# EAGLE design A_W_Sensor (EAGLE 6.4)
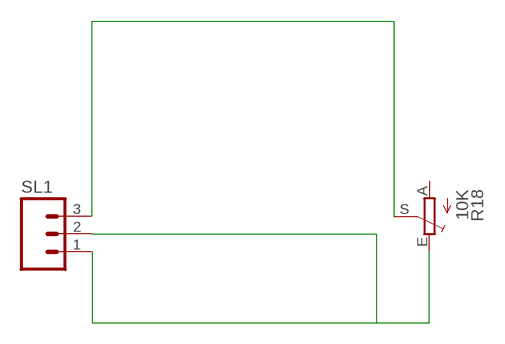
[diagram p0: schematic, sheet 1]

## Parts
R18  10K  TRIM_EU-CA6V  [CA6V]
SL1  M03  [03P]

## Nets
N$1: R18.S SL1.3
N$2: R18.E SL1.1 SL1.2
Unconnected: R18.A

## Library data of the parts
R18 = pot:TRIM_EU-: POTENTIOMETER
SL1 = con-amp-quick:M03: AMP QUICK CONNECTOR; OC_FARNELL: unknown; OC_NEWARK: unknown

## Net classes
0 default: width 0.254 mm, drill 0.305 mm, clearance 0.152 mm

## Board
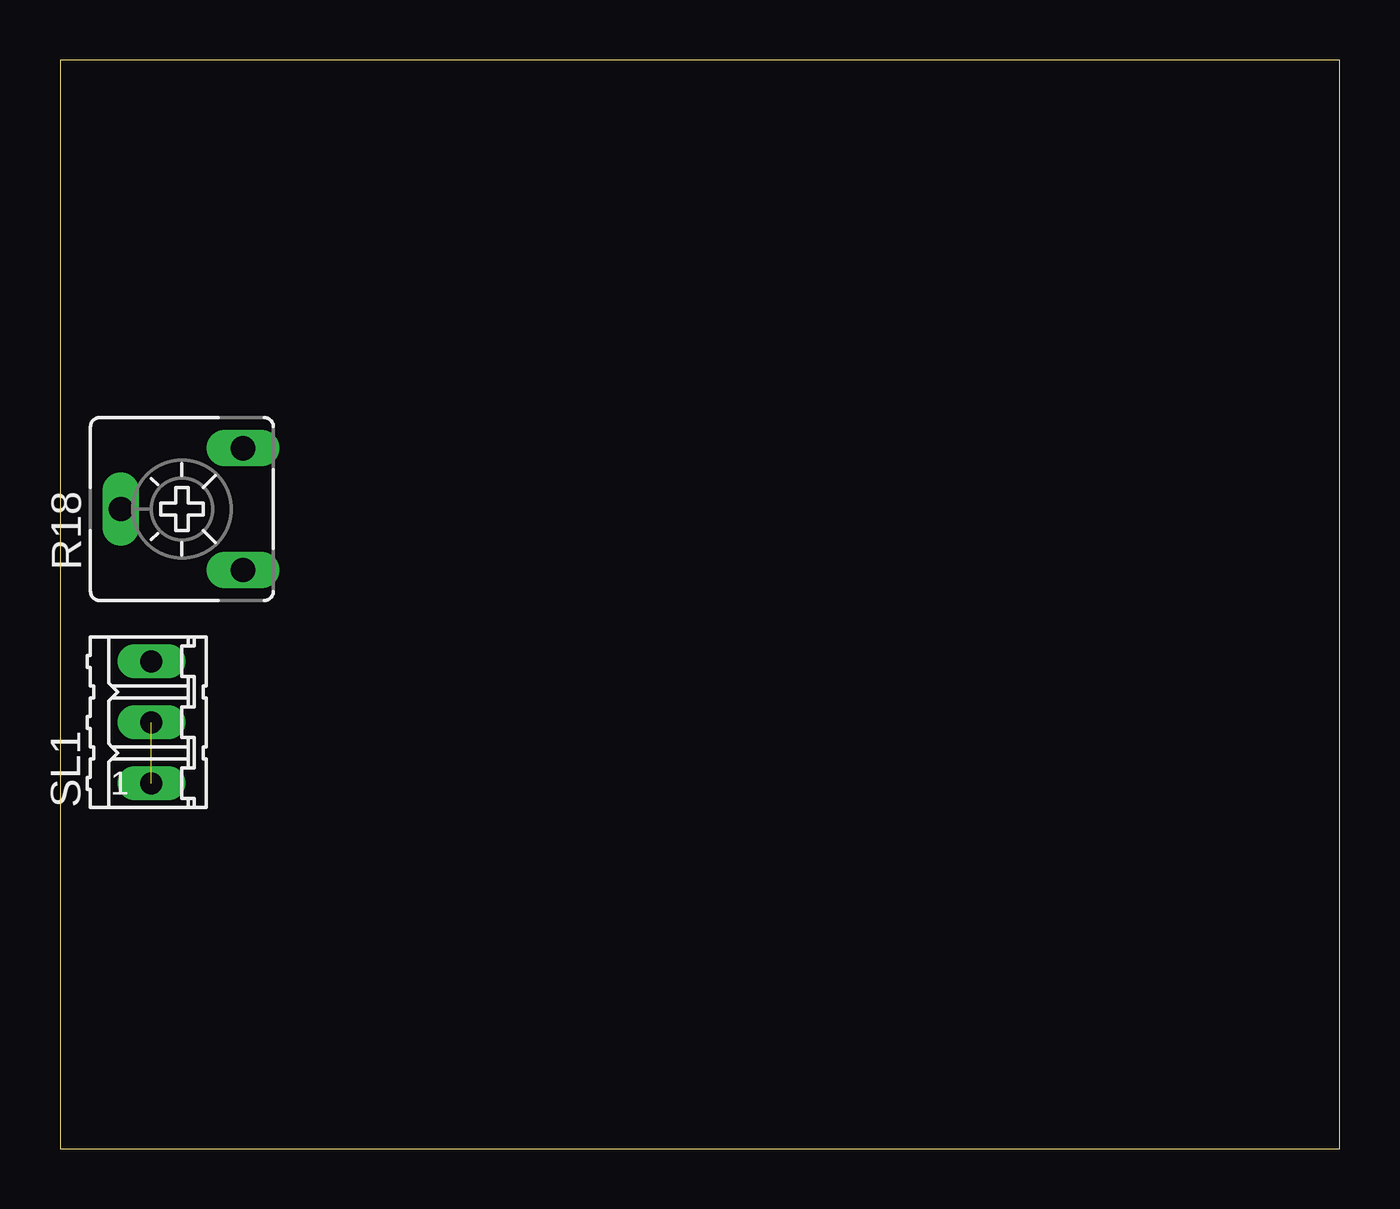
[diagram p1: board, top side]
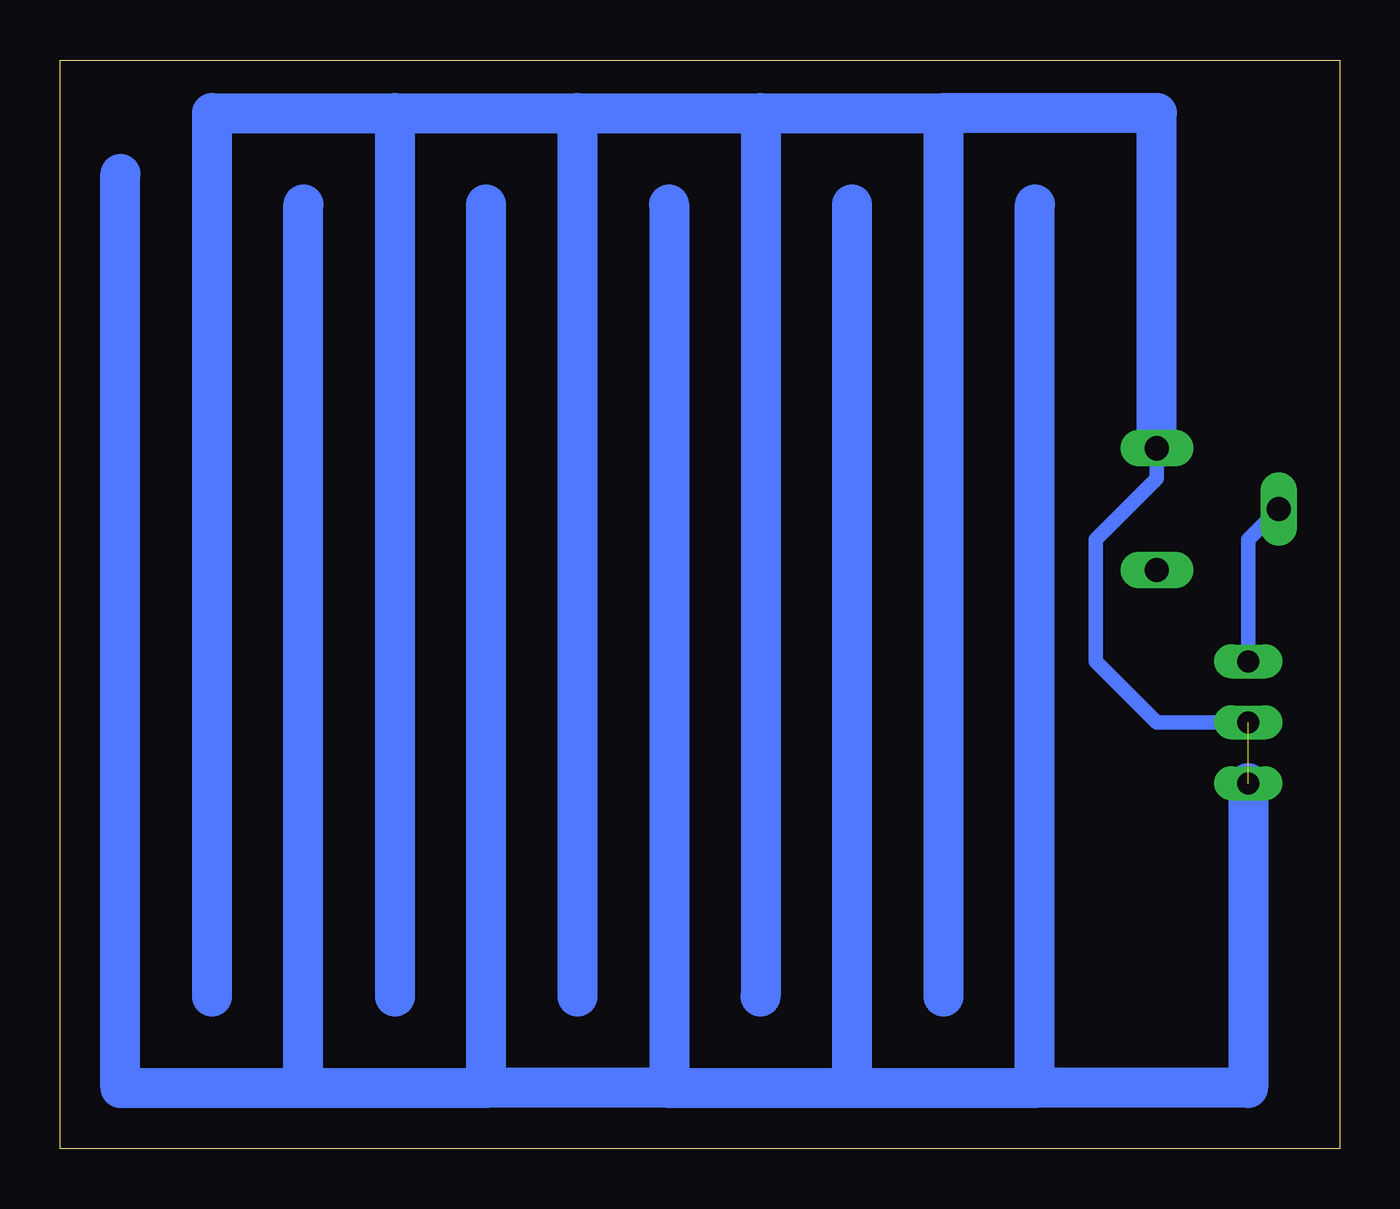
[diagram p2: board, bottom side, seen from below]

Size 53.32 x 45.39 mm. Coordinates in mm from the lower left corner, seen from the top.
Outline: 0,0 53.32,0 53.32,45.39 0,45.39 0,0
Copper layers (1*16): Top 0.035mm / dielectric 1.5mm / Bottom 0.035mm
Design rules "default": minimum track width 10mil, minimum drill 24mil, track to track 8mil, track to pad 8mil, pad to pad 8mil, via to via 8mil, smd to smd 8mil, copper to edge 40mil, drill to drill 8mil, minimum pad ring 10mil, minimum via ring 8mil, stop-mask expansion 4mil, vias tented up to drill 0mil, thermal gap 10mil

### Footprints (pad centres in the part's own frame; a part is rotated, then mirrored left to right if it is on the bottom)
CA6V = drill 1.016 long: A -2.54,-2.54; E 2.54,-2.54; S 0,2.54
03P = drill 0.914 long: 1 -2.54,0; 2 0,0; 3 2.54,0

### Placement (x,y rotation side)
R18  5.08,26.67 90 top
SL1  3.81,17.78 90 top

### Tracks (layer width: path | path; a pad name or v marks a point on that pad's centre or on a via)
N$1
  Bottom 0.61: SL1.3 3.81,25.4 R18.S
N$2  (1 unrouted)
  Bottom 0.61: 16.51,6.35 16.51,41.91 15.24,43.18 | 7.62,43.18 7.62,27.94 10.16,25.4 10.16,20.32 7.62,17.78 SL1.2
  Bottom 1.676: SL1.1 3.81,2.54 12.7,2.54 | 27.94,2.54 35.56,2.54 | 50.8,40.64 50.8,2.54 43.18,2.54 | R18.E 7.62,43.18 15.24,43.18 16.51,43.18 | 46.99,6.35 46.99,43.18 39.37,43.18 | 43.18,2.54 43.18,39.37 | 39.37,43.18 39.37,6.35 | 43.18,2.54 35.56,2.54 | 35.56,2.54 35.56,39.37 | 39.37,43.18 31.75,43.18 | 31.75,6.35 31.75,43.18 | 31.75,43.18 24.13,43.18 | 24.13,43.18 24.13,6.35 | 27.94,39.37 27.94,2.54 | 27.94,2.54 20.32,2.54 | 20.32,2.54 20.32,39.37 | 24.13,43.18 16.51,43.18 | 16.51,43.18 16.51,6.35 | 20.32,2.54 12.7,2.54 | 12.7,2.54 12.7,39.37